# EasyEDA schematic sch.json
TITLE: Sheet_1; REV: 1.0; Date: 2020-03-30; Sheet: 1/1; Drawn By: Fang_cy; Company: Your Company
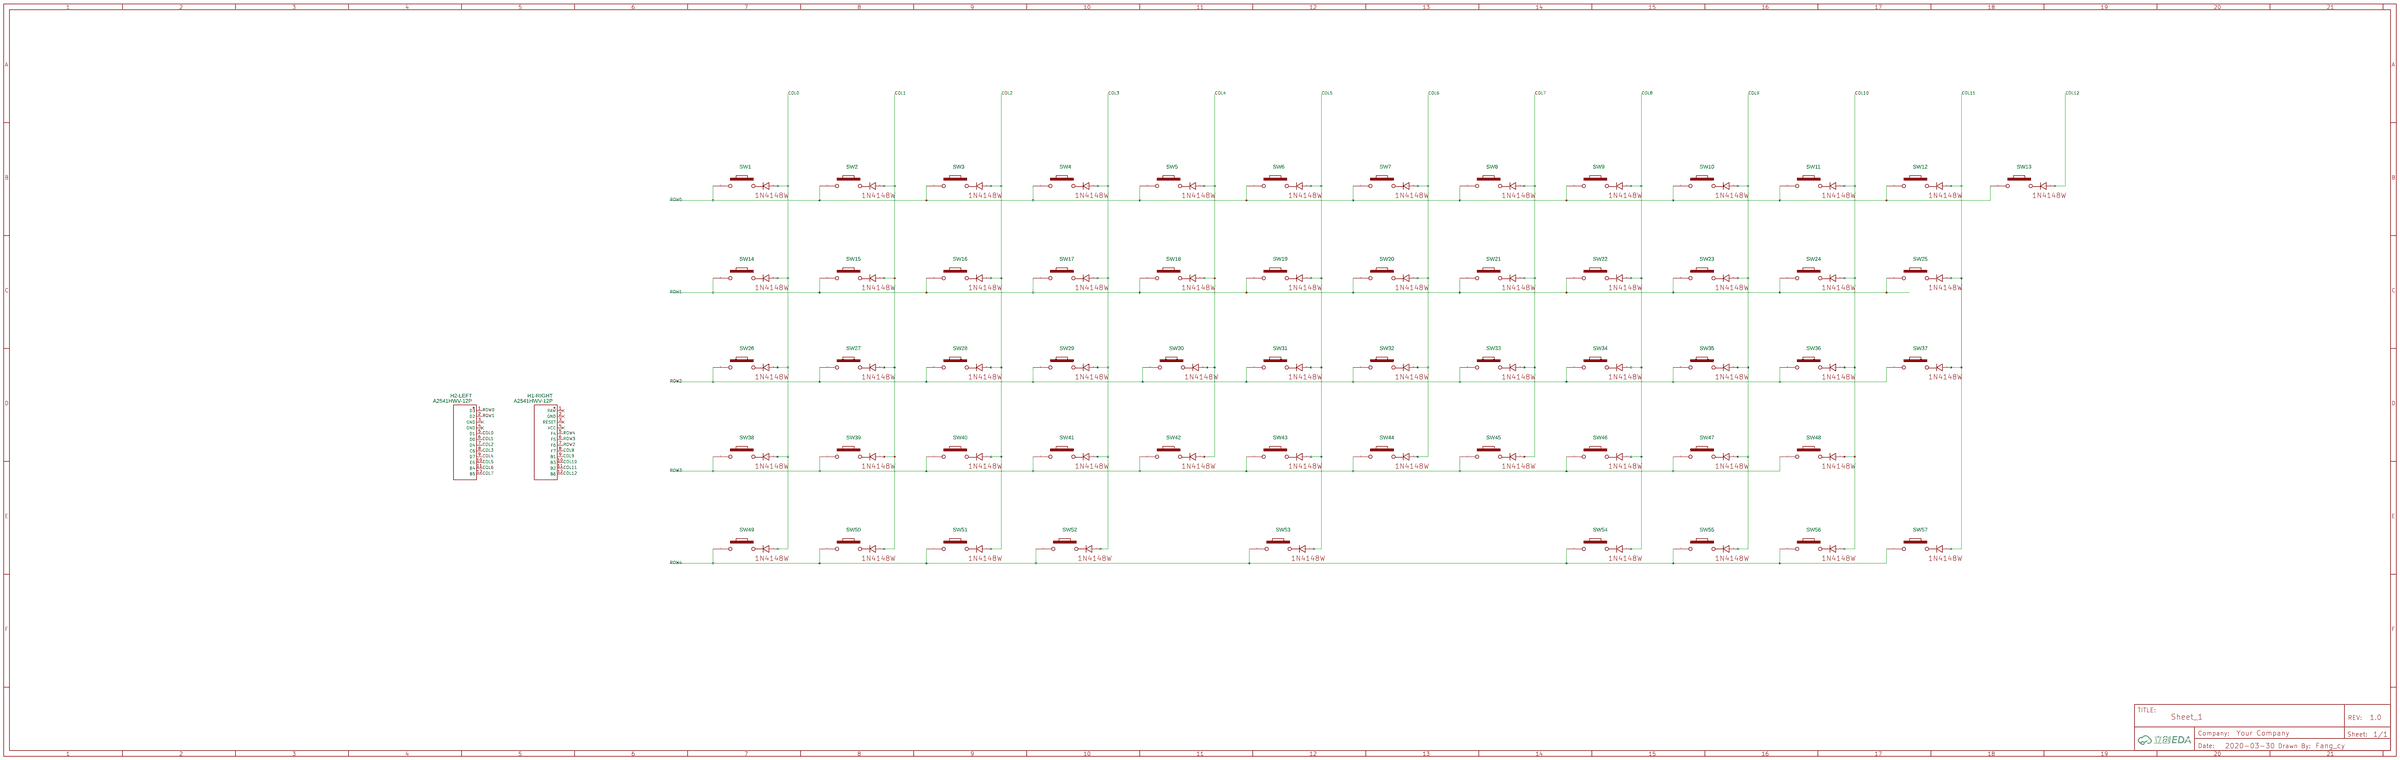
[diagram p0: schematic sheet]

## Parts
H1-RIGHT  A2541HWV-12P  [HDR-TH_12P-P2.54-V_A2541HWV-12P]
H2-LEFT  A2541HWV-12P  [HDR-TH_12P-P2.54-V_A2541HWV-12P]
SW1  CHERRY-Kaih+diode  [CHERRY-KEY-KAILH+DIODE]
SW2  CHERRY-Kaih+diode  [CHERRY-KEY-KAILH+DIODE]
SW3  CHERRY-Kaih+diode  [CHERRY-KEY-KAILH+DIODE]
SW4  CHERRY-Kaih+diode  [CHERRY-KEY-KAILH+DIODE]
SW5  CHERRY-Kaih+diode  [CHERRY-KEY-KAILH+DIODE]
SW6  CHERRY-Kaih+diode  [CHERRY-KEY-KAILH+DIODE]
SW7  CHERRY-Kaih+diode  [CHERRY-KEY-KAILH+DIODE]
SW8  CHERRY-Kaih+diode  [CHERRY-KEY-KAILH+DIODE]
SW9  CHERRY-Kaih+diode  [CHERRY-KEY-KAILH+DIODE]
SW10  CHERRY-Kaih+diode  [CHERRY-KEY-KAILH+DIODE]
SW11  CHERRY-Kaih+diode  [CHERRY-KEY-KAILH+DIODE]
SW12  CHERRY-Kaih+diode  [CHERRY-KEY-KAILH+DIODE]
SW13  CHERRY-Kaih+diode  [CHERRY-KEY-KAILH+DIODE]
SW14  CHERRY-Kaih+diode  [CHERRY-KEY-KAILH+DIODE]
SW15  CHERRY-Kaih+diode  [CHERRY-KEY-KAILH+DIODE]
SW16  CHERRY-Kaih+diode  [CHERRY-KEY-KAILH+DIODE]
SW17  CHERRY-Kaih+diode  [CHERRY-KEY-KAILH+DIODE]
SW18  CHERRY-Kaih+diode  [CHERRY-KEY-KAILH+DIODE]
SW19  CHERRY-Kaih+diode  [CHERRY-KEY-KAILH+DIODE]
SW20  CHERRY-Kaih+diode  [CHERRY-KEY-KAILH+DIODE]
SW21  CHERRY-Kaih+diode  [CHERRY-KEY-KAILH+DIODE]
SW22  CHERRY-Kaih+diode  [CHERRY-KEY-KAILH+DIODE]
SW23  CHERRY-Kaih+diode  [CHERRY-KEY-KAILH+DIODE]
SW24  CHERRY-Kaih+diode  [CHERRY-KEY-KAILH+DIODE]
SW25  CHERRY-Kaih+diode  [CHERRY-KEY-KAILH+DIODE]
SW26  CHERRY-Kaih+diode  [CHERRY-KEY-KAILH+DIODE]
SW27  CHERRY-Kaih+diode  [CHERRY-KEY-KAILH+DIODE]
SW28  CHERRY-Kaih+diode  [CHERRY-KEY-KAILH+DIODE]
SW29  CHERRY-Kaih+diode  [CHERRY-KEY-KAILH+DIODE]
SW30  CHERRY-Kaih+diode  [CHERRY-KEY-KAILH+DIODE]
SW31  CHERRY-Kaih+diode  [CHERRY-KEY-KAILH+DIODE]
SW32  CHERRY-Kaih+diode  [CHERRY-KEY-KAILH+DIODE]
SW33  CHERRY-Kaih+diode  [CHERRY-KEY-KAILH+DIODE]
SW34  CHERRY-Kaih+diode  [CHERRY-KEY-KAILH+DIODE]
SW35  CHERRY-Kaih+diode  [CHERRY-KEY-KAILH+DIODE]
SW36  CHERRY-Kaih+diode  [CHERRY-KEY-KAILH+DIODE]
SW37  CHERRY-Kaih+diode  [CHERRY-KEY-KAILH+DIODE]
SW38  CHERRY-Kaih+diode  [CHERRY-KEY-KAILH+DIODE]
SW39  CHERRY-Kaih+diode  [CHERRY-KEY-KAILH+DIODE]
SW40  CHERRY-Kaih+diode  [CHERRY-KEY-KAILH+DIODE]
SW41  CHERRY-Kaih+diode  [CHERRY-KEY-KAILH+DIODE]
SW42  CHERRY-Kaih+diode  [CHERRY-KEY-KAILH+DIODE]
SW43  CHERRY-Kaih+diode  [CHERRY-KEY-KAILH+DIODE]
SW44  CHERRY-Kaih+diode  [CHERRY-KEY-KAILH+DIODE]
SW45  CHERRY-Kaih+diode  [CHERRY-KEY-KAILH+DIODE]
SW46  CHERRY-Kaih+diode  [CHERRY-KEY-KAILH+DIODE]
SW47  CHERRY-Kaih+diode  [CHERRY-KEY-KAILH+DIODE]
SW48  CHERRY-Kaih+diode  [CHERRY-KEY-KAILH+DIODE]
SW49  CHERRY-Kaih+diode  [CHERRY-KEY-KAILH+DIODE]
SW50  CHERRY-Kaih+diode  [CHERRY-KEY-KAILH+DIODE]
SW51  CHERRY-Kaih+diode  [CHERRY-KEY-KAILH+DIODE]
SW52  CHERRY-Kaih+diode  [CHERRY-KEY-KAILH+DIODE]
SW53  CHERRY-Kaih+diode  [CHERRY-KEY-KAILH+DIODE]
SW54  CHERRY-Kaih+diode  [CHERRY-KEY-KAILH+DIODE]
SW55  CHERRY-Kaih+diode  [CHERRY-KEY-KAILH+DIODE]
SW56  CHERRY-Kaih+diode  [CHERRY-KEY-KAILH+DIODE]
SW57  CHERRY-Kaih+diode  [CHERRY-KEY-KAILH+DIODE]

## Library data of the parts
H1-RIGHT H2-LEFT = A2541HWV-12P: Supplier: LCSC; Supplier Part: C225509; Manufacturer: Changjiang Connectors; Contributor: LCSC
SW1-SW57 = CHERRY-Kaih+diode: Manufacturer: 00; Manufacturer Part: 00; Supplier Part: 00; Contributor: kero

## Nets
COL0: H2-LEFT.5(D1) SW1.col SW14.col SW26.col SW38.col SW49.col
COL1: H2-LEFT.6(D0) SW2.col SW15.col SW27.col SW39.col SW50.col
COL2: H2-LEFT.7(D4) SW3.col SW16.col SW28.col SW40.col SW51.col
COL3: H2-LEFT.8(C6) SW4.col SW17.col SW29.col SW41.col SW52.col
COL4: H2-LEFT.9(D7) SW5.col SW18.col SW30.col SW42.col
COL5: H2-LEFT.10(E6) SW6.col SW19.col SW31.col SW43.col SW53.col
COL6: H2-LEFT.11(B4) SW7.col SW20.col SW32.col SW44.col
COL7: H2-LEFT.12(B5) SW8.col SW21.col SW33.col SW45.col
COL8: H1-RIGHT.8(F7) SW9.col SW22.col SW34.col SW46.col SW54.col
COL9: H1-RIGHT.9(B1) SW10.col SW23.col SW35.col SW47.col SW55.col
COL10: H1-RIGHT.10(B3) SW11.col SW24.col SW36.col SW48.col SW56.col
COL11: H1-RIGHT.11(B2) SW12.col SW25.col SW37.col SW57.col
COL12: H1-RIGHT.12(B6) SW13.col
ROW0: H2-LEFT.1(D3) SW1.row SW2.row SW3.row SW4.row SW5.row SW6.row SW7.row SW8.row SW9.row SW10.row SW11.row SW12.row SW13.row
ROW1: H2-LEFT.2(D2) SW14.row SW15.row SW16.row SW17.row SW18.row SW19.row SW20.row SW21.row SW22.row SW23.row SW24.row SW25.row
ROW2: H1-RIGHT.7(F6) SW26.row SW27.row SW28.row SW29.row SW30.row SW31.row SW32.row SW33.row SW34.row SW35.row SW36.row SW37.row
ROW3: H1-RIGHT.6(F5) SW38.row SW39.row SW40.row SW41.row SW42.row SW43.row SW44.row SW45.row SW46.row SW47.row SW48.row
ROW4: H1-RIGHT.5(F4) SW49.row SW50.row SW51.row SW52.row SW53.row SW54.row SW55.row SW56.row SW57.row

Not connected (* = marked no-connect by the designer): H1-RIGHT 1(RAW)* 2(GND)* 3(RESET)* 4(VCC)*; H2-LEFT 3(GND)* 4(GND)*
